# EAGLE design Burn_bootloader_V1.2 (EAGLE 6.4)
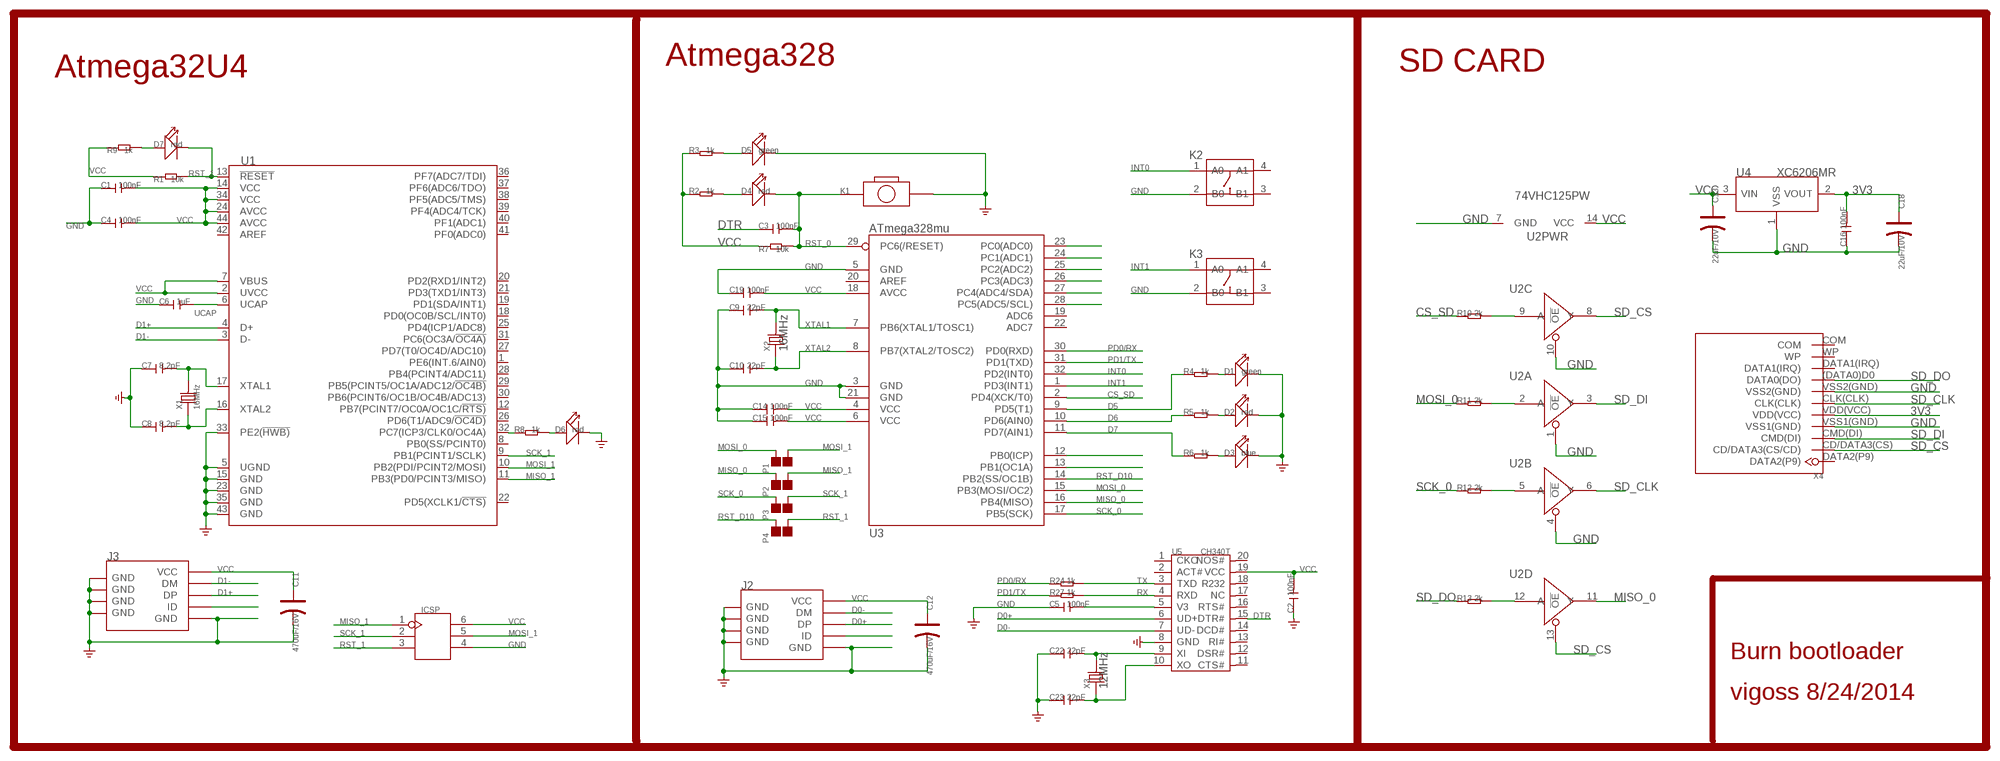
[diagram p0: schematic, sheet 1]

## Parts
C1  100nF  C-0603  [C0603]
C2  100nF  C-0603  [C0603]
C3  100nF  C-0603  [C0603]
C4  100nF  C-0603  [C0603]
C5  100nF  C-0603  [C0603]
C6  1uF  C-0603  [C0603]
C7  8.2pF  C-0603  [C0603]
C8  8.2pF  C-0603  [C0603]
C9  22pF  C-0603  [C0603]
C10  22pF  C-0603  [C0603]
C11  470uF/16V  CAP-AVX-C  [AVX-C]
C12  470uF/16V  CAP-AVX-C  [AVX-C]
C13  22uF/10V  CAP-AVX-A  [AVX-A]
C14  100nF  C-0603  [C0603]
C15  100nF  C-0603  [C0603]
C16  100nF  C-0805  [C0805]
C18  22uF/10V  CAP-AVX-A  [AVX-A]
C19  100nF  C-0603  [C0603]
C22  22pF  C-0603  [C0603]
C23  22pF  C-0603  [C0603]
D1  green  LED-6MM  [LED-2P-2.54-6MM]
D2  red  LED-6MM  [LED-2P-2.54-6MM]
D3  blue  LED-6MM  [LED-2P-2.54-6MM]
D4  red  LED'0603'  [LED-0603]
D5  green  LED'0603'  [LED-0603]
D6  red  LED'0603'  [LED-0603]
D7  red  LED'0603'  [LED-0603]
ICSP  HEADER-2X3P-2.54  [2X3P-2.54]
J2  USB-MINIUSB-5P-STRONG  [MINI-SMD-5P]
J3  USB-MINIUSB-5P-STRONG  [MINI-SMD-5P]
K1  BUTTON-2P'TS-1101F'  [2P-3.4X6.0X3.55H-90D]
K2  BUTTON-4P-6.2X6.2  [4P-6.2X6.2]
K3  BUTTON-4P-6.2X6.2  [4P-6.2X6.2]
P1  PAD-JUMPER-2P  [2P-SMD-1.78X1.27]
P2  PAD-JUMPER-2P  [2P-SMD-1.78X1.27]
P3  PAD-JUMPER-2P  [2P-SMD-1.78X1.27]
P4  PAD-JUMPER-2P  [2P-SMD-1.78X1.27]
R1  10k  R-0603  [R0603]
R2  1k  R-0603  [R0603]
R3  1k  R-0603  [R0603]
R4  1k  R-0603  [R0603]
R5  1k  R-0603  [R0603]
R6  1k  R-0603  [R0603]
R7  10k  R-0603  [R0603]
R8  1k  R-0603  [R0603]
R9  1k  R-0603  [R0603]
R10  2k  R-0603  [R0603]
R11  2k  R-0603  [R0603]
R12  2k  R-0603  [R0603]
R13  2k  R-0603  [R0603]
R24  1k  R-0603  [R0603]
R27  1k  R-0603  [R0603]
U1  MCU-ATMEGA32U4  [TEST-VQFN-44]
U2  74VHC125PW  [TSSOP14]
U3  ATmega328mu  ATMEGA8/168/328  [TQFP32]
U4  XC6206MR  [SOT23]
U5  CH340T  [SSOP20]
X1  16MHz  CRYSTAL'5032'  [2P-SMD-5X3.2]
X2  16MHz  CRYSTAL'5032'  [2P-SMD-5X3.2]
X3  12MHz  CRYSTAL'5032'  [2P-SMD-5X3.2]
X4  SDCARDEXTDEVICE  [SDCARDEXTPACKAGE]

## Nets
3V3: C16.2 C18.+ U4.2(VOUT) X4.VDD(VCC)
CS_SD: R10.1 U3.2(PD4(XCK/T0))
D0+: J2.3(DP) U5.6(UD+)
D0-: J2.2(DM) U5.7(UD-)
D1+: J3.3(DP) U1.4(D+)
D1-: J3.2(DM) U1.3(D-)
D5: R4.1 U3.9(PD5(T1))
D6: R5.1 U3.10(PD6(AIN0))
D7: R6.1 U3.11(PD7(AIN1))
DTR: C3.1 U5.15(DTR#)
GND [none1]: C1.1 C2.1 C4.1 C5.1 C6.1 C7.1 C8.1 C9.1 C10.1 C11.- C12.- C13.- C14.1 C15.1 C16.1 C18.- C19.1 C22.1 C23.1 D1.- D2.- D3.- D5.- D6.- ICSP.4 J2.5(GND) J2.GND@1(GND) J2.GND@2(GND) J2.GND@3(GND) J2.GND@4(GND) J3.5(GND) J3.GND@1(GND) J3.GND@2(GND) J3.GND@3(GND) J3.GND@4(GND) K1.P$2 K2.2(B0) K3.2(B0) U1.5(UGND) U1.15(GND) U1.23(GND) U1.33(PE2(!HWB)) U1.35(GND) U1.43(GND) U2.1(A:!OE) U2.4(B:!OE) U2.7(PWR:GND) U2.10(C:!OE) U3.3(GND) U3.5(GND) U3.21(GND) U4.1(VSS) U5.8(GND) X4.VSS1(GND) X4.VSS2(GND)
INT0: K2.1(A0) U3.32(PD2(INT0))
INT1: K3.1(A0) U3.1(PD3(INT1))
MISO_0: P2.2 U2.11(D:Y) U3.16(PB4(MISO))
MISO_1: ICSP.1 P2.1 U1.11(PB3(PD0/PCINT3/MISO))
MOSI_0: P1.2 R11.1 U3.15(PB3(MOSI/OC2))
MOSI_1: ICSP.5 P1.1 U1.10(PB2(PDI/PCINT2/MOSI))
N$1: J2.4(ID)
N$2: J3.4(ID)
N$3: D1.+ R4.2
N$4: D2.+ R5.2
N$5: D4.+ R2.2
N$6: D5.+ R3.2
N$7: D3.+ R6.2
N$8: R8.1 U1.32(PC7(ICP3/CLK0/OC4A))
N$9: D6.+ R8.2
N$10: D7.+ R9.2
N$11: C7.2 U1.17(XTAL1) X1.2
N$12: C8.2 U1.16(XTAL2) X1.1
N$13: R13.2 U2.12(D:A)
N$14: R12.2 U2.5(B:A)
N$15: R11.2 U2.2(A:A)
N$16: R10.2 U2.9(C:A)
N$17: U3.23(PC0(ADC0))
N$18: U3.24(PC1(ADC1))
N$19: U3.25(PC2(ADC2))
N$20: U3.26(PC3(ADC3))
N$21: U3.27(PC4(ADC4/SDA))
N$22: U3.28(PC5(ADC5/SCL))
N$23: U3.12(PB0(ICP))
N$24: U3.13(PB1(OC1A))
N$39: C22.2 U5.9(XI) X3.2
N$40: C23.2 U5.10(XO) X3.1
PD0/RX: R24.1 U3.30(PD0(RXD))
PD1/TX: R27.1 U3.31(PD1(TXD))
RST_0: C3.2 D4.- K1.P$1 R7.2 U3.29(PC6(/RESET))
RST_1: D7.- ICSP.3 P4.1 R1.2 U1.13(!RESET)
RST_D10: P4.2 U3.14(PB2(SS/OC1B))
RX: R27.2 U5.4(RXD)
SCK_0: P3.2 R12.1 U3.17(PB5(SCK))
SCK_1: ICSP.2 P3.1 U1.9(PB1(PCINT1/SCLK))
SD_CLK: U2.6(B:Y) X4.CLK(CLK)
SD_CS: U2.8(C:Y) U2.13(D:!OE) X4.CD/DATA3(CS)(CD/DATA3(CS/CD))
SD_DI: U2.3(A:Y) X4.CMD(DI)
SD_DO: R13.1 X4.(DATA0)D0(DATA0(DO))
TX: R24.2 U5.3(TXD)
UCAP: C6.2 U1.6(UCAP)
V3: C5.2 U5.5(V3)
VCC: C1.2 C2.2 C4.2 C11.+ C12.+ C13.+ C14.2 C15.2 C19.2 ICSP.6 J2.1(VCC) J3.1(VCC) R1.1 R2.1 R3.1 R7.1 R9.1 U1.2(UVCC) U1.7(VBUS) U1.14(VCC) U1.24(AVCC) U1.34(VCC) U1.44(AVCC) U2.14(PWR:VCC) U3.4(VCC) U3.6(VCC) U3.18(AVCC) U4.3(VIN) U5.19(VCC)
XTAL1: C9.2 U3.7(PB6(XTAL1/TOSC1)) X2.2
XTAL2: C10.2 U3.8(PB7(XTAL2/TOSC2)) X2.1
Unconnected: K2.3(B1) K2.4(A1) K3.3(B1) K3.4(A1) U1.1(PE6(INT.6/AIN0)) U1.8(PB0(SS/PCINT0)) U1.12(PB7(PCINT7/OC0A/OC1C/!RTS)) U1.18(PD0(OC0B/SCL/INT0)) U1.19(PD1(SDA/INT1)) U1.20(PD2(RXD1/INT2)) U1.21(PD3(TXD1/INT3)) U1.22(PD5(XCLK1/!CTS)) U1.25(PD4(ICP1/ADC8)) U1.26(PD6(T1/ADC9/!OC4D)) U1.27(PD7(T0/OC4D/ADC10)) U1.28(PB4(PCINT4/ADC11)) U1.29(PB5(PCINT5/OC1A/ADC12/!OC4B)) U1.30(PB6(PCINT6/OC1B/OC4B/ADC13)) U1.31(PC6(OC3A/!OC4A)) U1.36(PF7(ADC7/TDI)) U1.37(PF6(ADC6/TDO)) U1.38(PF5(ADC5/TMS)) U1.39(PF4(ADC4/TCK)) U1.40(PF1(ADC1)) U1.41(PF0(ADC0)) U1.42(AREF) U3.19(ADC6) U3.20(AREF) U3.22(ADC7) U5.1(CKO) U5.2(ACT#) U5.11(CTS#) U5.12(DSR#) U5.13(RI#) U5.14(DCD#) U5.16(RTS#) U5.17(NC) U5.18(R232) U5.20(NOS#) X4.COM X4.DATA1(IRQ) X4.DATA2(P9) X4.WP

## Notes on the sheet
- Atmega328 | SD CARD
- Atmega32U4
- Burn bootloader
- vigoss 8/24/2014

## Library data of the parts
C1-C10 C14-C16 C19 C22 C23 = Discrete:C*: Ceramic Capacitors
C11-C13 C18 = Discrete:CAP*: Electrolytic Capacitors,Tantalum Capacitors and Super Capacitors
D1-D7 = Discrete:LED*
ICSP = Connector :HEADER-2X3P
J2 J3 = Connector :USB-MINIUSB-5P
K1 = Discrete:BUTTON-2P
K2 K3 = Discrete:BUTTON-4P
P1-P4 = Discrete:PAD-JUMPER-2P; PARTNO: DNP
R1-R13 R24 R27 = Discrete:R*
U1 = goodman:MCU-ATMEGA32U4
U2 = IC:74V*125: Quad Buffer/Line Driver;3-state
U3 = IC:ATMEGA8/168/328: MICROCONTROLLER
U4 = IC:XC6206: LOW ESR Cap.Compatible Positive Voltage Regulators
U5 = template:CH340T
X1-X3 = Discrete:CRYSTAL*: CRYSTAL
X4 = SD card breakout:SDCARDEXTDEVICE

## Net classes
0 default: clearance 0.152 mm
3 none3: width 0.203 mm, drill 0.305 mm, clearance 0.203 mm

## Board
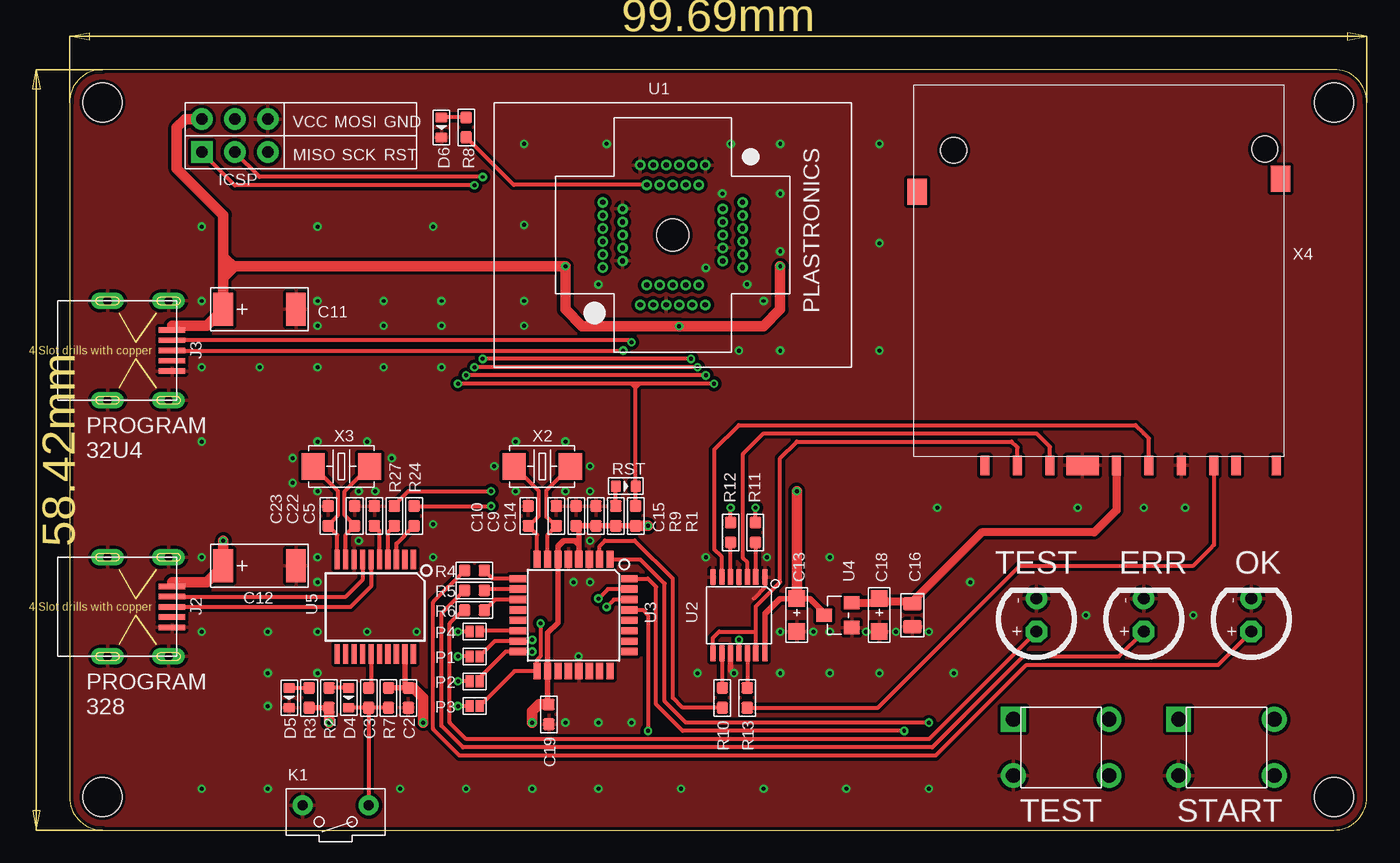
[diagram p1: board, top side]
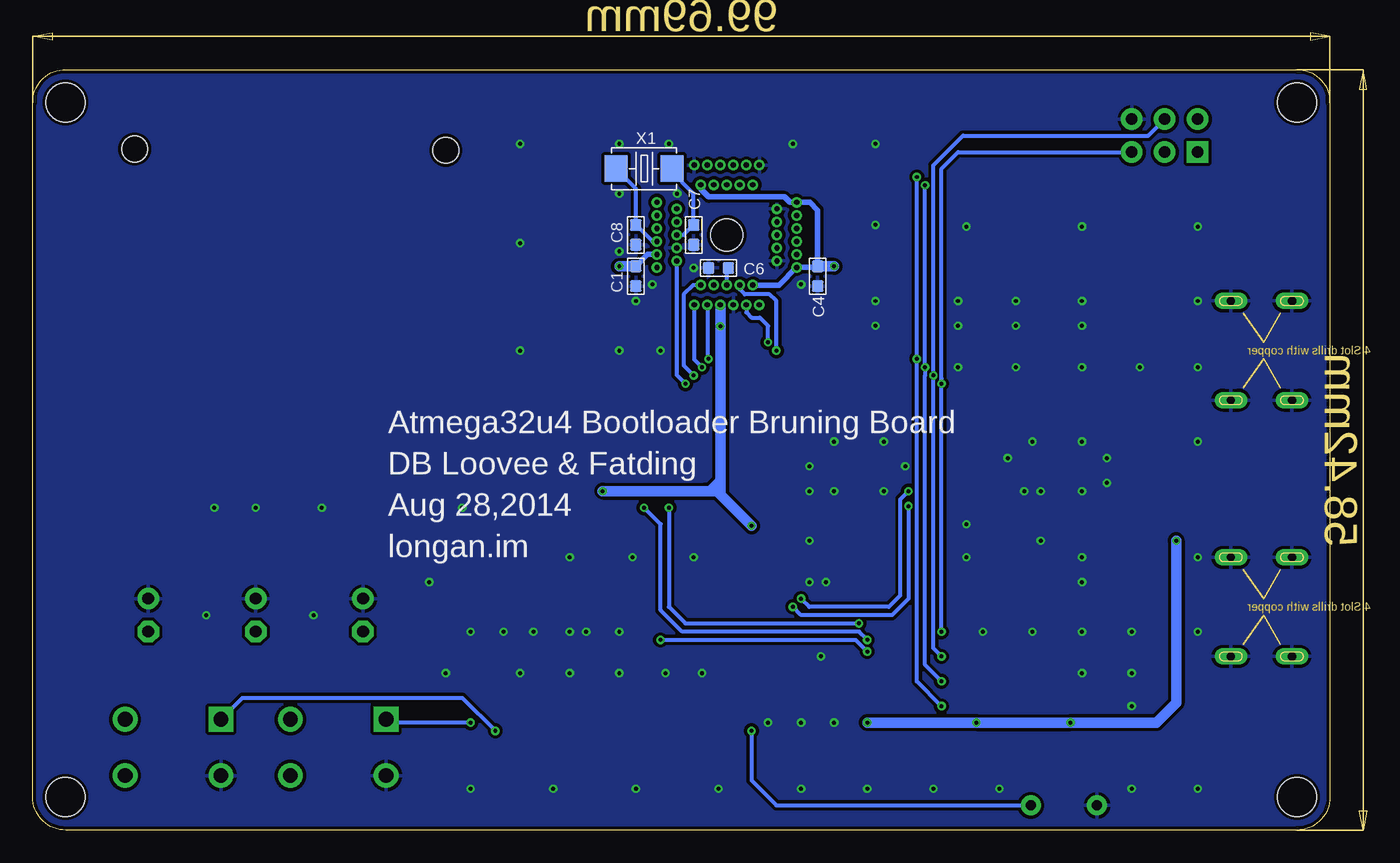
[diagram p2: board, bottom side, seen from below]

Size 99.69 x 58.42 mm. Coordinates in mm from the lower left corner, seen from the top.
Outline: 97.16,58.42 2.54,58.42 arc90 0,55.88 0,2.54 arc90 2.54,0 97.16,0 arc90 99.69,2.54 99.69,55.88 arc90 97.16,58.42
Copper layers (1*16): Top 0.035mm / dielectric 1.5mm / Bottom 0.035mm
Design rules "SeeedStudio_2layer_DRU_no_angle_20140221 *": minimum track width 6mil, minimum drill 12mil, track to track 6mil, track to pad 6mil, pad to pad 6mil, via to via 6mil, smd to smd 0mil, copper to edge 10mil, drill to drill 10mil, minimum pad ring 5mil, minimum via ring 6mil, stop-mask expansion 2mil, vias tented up to drill 100mil, thermal gap 10mil
Holes 3 mm at 2.54,55.88 2.54,2.54 97.16,2.54 97.16,55.88

### Footprints (pad centres in the part's own frame; a part is rotated, then mirrored left to right if it is on the bottom)
C0603 = smd 0.889 x 0.889: 1 -0.762,0; 2 0.762,0
AVX-C = smd 1.524 x 2.54: + -2.794,0; - 2.794,0
AVX-A = smd 1.27 x 1.27: + -1.27,0; - 1.27,0
C0805 = smd 1.016 x 1.397: 1 -0.889,0; 2 0.889,0
LED-2P-2.54-6MM = drill 0.889 pad 1.651 octagon: + -1.27,0 | drill 0.889 pad 1.651: - 1.27,0
LED-0603 = smd 0.762 x 0.889: + -0.762,0; - 0.762,0
2X3P-2.54 = drill 0.889 pad 1.651 square: 1 -1.27,2.54 | drill 0.889 pad 1.651: 2 -1.27,0; 3 -1.27,-2.54; 4 1.27,-2.54; 5 1.27,0; 6 1.27,2.54
MINI-SMD-5P = smd 2.032 x 0.406: 1 0.381,-1.575; 2 0.381,-0.787; 3 0.381,0; 4 0.381,0.787; 5 0.381,1.575 | drill 0.635 pad 1.27 long: GND@1 0.635,3.81; GND@2 5.334,3.81; GND@3 5.334,-3.81; GND@4 0.635,-3.81
2P-3.4X6.0X3.55H-90D = drill 0.762 pad 1.524: P$1 0,2.54; P$2 0,-2.54
4P-6.2X6.2 = drill 1.143 pad 1.905 square: 1 -3.683,2.159 | drill 1.143 pad 1.905: 2 -3.683,-2.159; 3 3.683,-2.159; 4 3.683,2.159
2P-SMD-1.78X1.27 = smd 0.889 x 0.61: 1 0,0.381; 2 0,-0.381
R0603 = smd 0.889 x 0.889: 1 -0.762,0; 2 0.762,0
TEST-VQFN-44 = drill 0.4 pad 0.8: 1 -2.5,-5.37; 2 -2,-3.85; 3 -1.5,-5.37; 4 -1,-3.85; 5 -0.5,-5.37; 6 0,-3.85; 7 0.5,-5.37; 8 1,-3.85; 9 1.5,-5.37; 10 2,-3.85; 11 2.5,-5.37; 12 5.37,-2.5; 13 3.85,-2; 14 5.37,-1.5; 15 3.85,-1; 16 5.37,-0.5; 17 3.85,0; 18 5.37,0.5; 19 3.85,1; 20 5.37,1.5; 21 3.85,2; 22 5.37,2.5; 23 2.5,5.37; 24 2,3.85; 25 1.5,5.37; 26 1,3.85; 27 0.5,5.37; 28 0,3.85; 29 -0.5,5.37; 30 -1,3.85; 31 -1.5,5.37; 32 -2,3.85; 33 -2.5,5.37; 34 -5.37,2.5; 35 -3.85,2; 36 -5.37,1.5; 37 -3.85,1; 38 -5.37,0.5; 39 -3.85,0; 40 -5.37,-0.5; 41 -3.85,-1; 42 -5.37,-1.5; 43 -3.85,-2; 44 -5.37,-2.5 | hole 2.5: 0,0
TSSOP14 = smd 0.4 x 1.2: 1 -2,-2.925; 2 -1.3,-2.925; 3 -0.65,-2.925; 4 0,-2.925; 5 0.65,-2.925; 6 1.3,-2.925; 7 2,-2.925; 8 2,2.925; 9 1.3,2.925; 10 0.65,2.925; 11 0,2.925; 12 -0.65,2.925; 13 -1.3,2.925; 14 -2,2.925
TQFP32 = smd 1.27 x 0.559: 1 -4.293,2.8; 2 -4.293,2; 3 -4.293,1.2; 4 -4.293,0.4; 5 -4.293,-0.4; 6 -4.293,-1.2; 7 -4.293,-2; 8 -4.293,-2.8; 17 4.293,-2.8; 18 4.293,-2; 19 4.293,-1.2; 20 4.293,-0.4; 21 4.293,0.4; 22 4.293,1.2; 23 4.293,2; 24 4.293,2.8 | smd 0.559 x 1.27: 9 -2.8,-4.293; 10 -2,-4.293; 11 -1.2,-4.293; 12 -0.4,-4.293; 13 0.4,-4.293; 14 1.2,-4.293; 15 2,-4.293; 16 2.8,-4.293; 25 2.8,4.293; 26 2,4.293; 27 1.2,4.293; 28 0.4,4.293; 29 -0.4,4.293; 30 -1.2,4.293; 31 -2,4.293; 32 -2.8,4.293
SOT23 = smd 1.016 x 1.2: 1 -0.95,-1.06; 2 0.95,-1.06; 3 0,1.06
SSOP20 = smd 0.4 x 1.5: 1 -2.925,-3.625; 2 -2.275,-3.625; 3 -1.625,-3.625; 4 -0.975,-3.625; 5 -0.325,-3.625; 6 0.325,-3.625; 7 0.975,-3.625; 8 1.625,-3.625; 9 2.275,-3.625; 10 2.925,-3.625; 11 2.925,3.625; 12 2.275,3.625; 13 1.625,3.625; 14 0.975,3.625; 15 0.325,3.625; 16 -0.325,3.625; 17 -0.975,3.625; 18 -1.625,3.625; 19 -2.275,3.625; 20 -2.925,3.625
2P-SMD-5X3.2 = smd 1.778 x 2.032: 1 -2.159,0; 2 2.159,0
SDCARDEXTPACKAGE = smd 1.5 x 0.7: (DATA0)D0 -15.8,-9.2; CD/DATA3(CS) -15.8,5.9; CLK(CLK) -15.8,-4.2; CMD(DI) -15.8,3.4; DATA1(IRQ) -15.8,-10.9; DATA2(P9) -15.8,8.4; VDD(VCC) -15.8,-1.7; VSS2(GND) -15.8,-6.7; WP -15.8,-14 | smd 2 x 1.5: COM 6.2,-14.3; P$2 5.2,13.6 | smd 1.5 x 2.5: VSS1(GND) -15.8,0.9 | hole 2: 8.4,10.8; 8.5,-13.1

### Placement (x,y rotation side)
C1  53.34,42.55 90 bottom
C2  26.04,10.16 90 top
C3  22.99,10.16 270 top
C4  39.37,42.55 90 bottom
C5  23.43,24.13 270 top
C6  46.99,43.18 0 bottom
C7  48.9,45.72 90 bottom
C8  53.34,45.72 90 bottom
C9  37.4,24.13 270 top
C10  35.24,24.13 270 top
C11  14.61,40.01 0 top
C12  14.61,20.32 0 top
C13  55.88,16.51 270 top
C14  38.93,24.13 270 top
C15  40.45,24.13 270 top
C16  64.77,16.51 90 top
C18  62.23,16.51 270 top
C19  36.83,8.89 90 top
C22  21.91,24.13 270 top
C23  19.88,24.13 270 top
D1  90.81,16.51 90 top
D2  82.55,16.51 90 top
D3  74.3,16.51 90 top
D4  21.46,10.16 270 top
D5  16.89,10.16 270 top
D6  28.57,53.98 270 top
D7  42.74,26.42 0 top
ICSP  12.7,53.34 90 top
J2  8.26,17.14 180 top
J3  8.26,36.83 180 top
K1  20.45,1.91 270 top
K2  88.9,6.35 0 top
K3  76.2,6.35 0 top
P1  31.11,13.34 90 top
P2  31.11,11.43 90 top
P3  31.11,9.53 90 top
P4  31.11,15.24 90 top
R1  43.5,24.13 90 top
R2  19.94,10.16 90 top
R3  18.41,10.16 90 top
R4  31.11,19.94 180 top
R5  31.11,18.41 180 top
R6  31.11,16.89 180 top
R7  24.51,10.16 270 top
R8  30.48,53.98 90 top
R9  41.97,24.13 90 top
R10  50.16,10.16 90 top
R11  52.7,22.86 270 top
R12  50.8,22.86 270 top
R13  52.07,10.16 90 top
R24  26.48,24.13 270 top
R27  24.96,24.13 270 top
U1  46.35,45.72 0 top
U2  51.44,16.51 180 top
U3  38.73,16.51 270 top
U4  59.05,16.51 90 top
U5  23.5,17.14 180 top
X1  52.7,50.8 0 bottom
X2  36.32,27.94 0 top
X3  20.89,27.94 0 top
X4  78.74,43.81 90 top

### Tracks (layer width: path | path; a pad name or v marks a point on that pad's centre or on a via)
3V3
  Top 0.61: C16.2 64.77,17.53 | 64.77,17.53 62.48,17.53 C18.+ 61.91,17.46 U4.2 | X4.VDD(VCC) 80.44,24.56 78.74,22.86 70.1,22.86 64.77,17.53
CS_SD
  Top 0.305: U3.2 40.73,21.81 41.15,22.23 43.43,22.23 46.35,19.3 46.35,10.16 47.12,9.4 R10.1
D0+
  Top 0.305: J2.3 21.59,17.14 23.17,18.73 U5.6
D0-
  Top 0.305: J2.2 21.23,17.93 22.52,19.22 U5.7
D1+  (via drill 0.3 pad 0.64)
  Top 0.305: J3.3 v42.55,36.83
  Bottom 0.305: v42.55,36.83 42.55,40.64 43.05,41.15 44.96,41.15 45.34,41.53 45.34,41.85 U1.4
D1-  (via drill 0.3 pad 0.64)
  Top 0.305: J3.2 43.03,37.62 v43.18,37.47
  Bottom 0.305: v43.18,37.47 43.18,38.73 43.81,39.37 44.45,39.37 44.85,39.77 U1.3
D5
  Top 0.305: U3.9 32.51,19.31 R4.1
D6
  Top 0.305: U3.10 31.97,18.51 R5.1
D7
  Top 0.305: U3.11 32.7,17.71 R6.1
DTR
  Top 0.305: U5.15 23.17,11.11 C3.1
GND  (via drill 0.3 pad 0.64)
  Top 0.305: U2.1 53.44,18.64 52.58,17.78
  Top 0.406: U2.10 50.78,12.33 v51.05,12.06
  other vias: 19.05,40.64 19.05,38.73 57.15,15.24 58.42,15.24 54.61,15.24 61.21,15.24 63.5,15.24 66.04,15.24 53.59,20.95 48.9,20.95 40.01,22.23 40.01,19.05 39.12,13.34 38.73,19.05 38.1,8.26 40.64,8.26 43.18,8.26 19.05,20.95 19.05,19.05 22.23,22.23 19.05,29.84 22.86,29.84 23.5,26.04 22.23,26.04 24.77,28.57 17.14,28.57 19.05,26.04 17.14,26.67 32.64,27.94 34.29,29.84 38.1,29.84 40.01,27.94 40.01,26.04 38.1,26.04 34.29,26.04 40.64,41.91 48.9,43.18 52.07,41.91 53.34,40.64 54.61,44.45 50.16,48.9 54.61,48.9 54.61,52.7 50.8,52.7 10.16,15.24 10.16,20.95 10.16,35.56 10.16,40.64 28.57,40.64 28.57,38.73 34.92,40.64 34.92,38.73 27.94,23.5 27.94,20.95 15.24,9.53 15.24,15.24 19.05,15.24 19.05,12.06 15.24,12.06 25.4,3.17 30.48,3.17 35.56,3.17 40.64,3.17 10.16,3.17 15.24,3.17 22.86,15.24 26.67,15.24 54.61,12.06 58.42,12.06 62.23,12.06 67.94,12.06 78.11,16.51 86.36,16.51 82.55,24.77 85.72,24.77 77.47,24.77 69.22,19.05 19.05,46.35 27.94,46.35 34.92,46.48 34.92,52.7 41.27,52.7 54.61,36.83 51.44,36.83 46.99,3.17 53.34,3.17 59.69,3.17 66.04,3.17 62.23,52.7 62.23,36.83 62.23,45.09 10.16,29.84 14.61,35.56 19.05,35.56 28.57,35.56 24.13,40.64 24.13,38.73 24.13,35.56 48.26,12.06 66.67,24.77 58.42,20.95 10.16,46.35
  pour Bottom (isolate 0.254): 0,0 99.69,0 99.69,58.42 0,58.42
  pour Top (isolate 0.254): 0,0 99.69,0 99.69,58.42 0,58.42
INT0  (via drill 0.3 pad 0.64)
  Top 0.305: U3.32 44.44,19.31 45.02,18.73 45.09,18.67 45.09,9.65 47.12,7.62 v64.14,7.62
  Bottom 0.305: K2.1 83.57,10.16 66.67,10.16 v64.14,7.62
INT1  (via drill 0.3 pad 0.64)
  Top 0.305: U3.1 43.84,20.8 45.72,18.92 45.72,9.91 47.37,8.26 v66.04,8.26
  Bottom 0.305: v66.04,8.26 72.26,8.26 K3.1
MISO_0  (via drill 0.3 pad 0.64)
  Top 0.305: U2.11 v51.44,14.61 | v35.56,13.72 U3.16 33.52,13.71 31.5,11.68 P2.2
  Bottom 0.305: v51.44,14.61 36.45,14.61 v35.56,13.72
MISO_1  (via drill 0.3 pad 0.64)
  Top 0.305: P2.1 v29.84,11.43 | ICSP.1 12.7,49.53 v31.11,49.53 | v48.26,35.56 v31.11,35.56
  Bottom 0.305: v29.84,11.43 31.11,12.7 31.11,34.92 v31.11,35.56 v31.11,49.53 | U1.11 48.85,36.15 v48.26,35.56
MOSI_0  (via drill 0.3 pad 0.64)
  Top 0.305: P1.2 32.67,14.51 U3.15 35.47,14.51 v35.56,14.61 | R11.1 v52.7,24.77
  Bottom 0.305: v35.56,14.61 36.2,15.24 49.78,15.24 51.44,16.89 51.44,23.5 v52.7,24.77
MOSI_1  (via drill 0.3 pad 0.64)
  Top 0.305: P1.1 v29.84,13.34 | v48.9,34.92 v30.48,34.92
  Bottom 0.305: v29.84,13.34 30.48,13.97 30.48,34.67 v30.48,34.92 30.48,51.05 28.19,53.34 13.97,53.34 ICSP.5 | U1.10 48.94,41.87 49.66,41.15 49.66,35.69 v48.9,34.92
N$3
  Top 0.305: R4.2 27.94,17.53 27.94,7.75 29.97,5.71 66.55,5.71 73.53,12.7 88.27,12.7 D1.+
N$4
  Top 0.305: R5.2 28.57,16.64 28.57,8 30.23,6.35 66.29,6.35 73.28,13.34 80.64,13.34 D2.+
N$5
  Top 0.305: D4.+ R2.2
N$6
  Top 0.305: D5.+ R3.2
N$7
  Top 0.305: R6.2 30.23,16.89 29.21,15.88 29.21,8.26 30.48,6.99 66.04,6.99 D3.+
N$8
  Top 0.305: U1.32 34.13,49.56 R8.1
N$9
  Top 0.305: R8.2 D6.+
N$10
  Top 0.305: R9.2 D7.+
N$11
  Bottom 0.305: U1.17 49.66,45.72 C7.2 48.9,48.9 50.67,50.67 X1.2
N$12
  Bottom 0.305: U1.16 52.07,45.22 C8.2 53.34,49.28 X1.1
N$13
  Top 0.305: U2.12 52.09,10.94 R13.2
N$14
  Top 0.305: U2.5 50.78,22.08 R12.2
N$15
  Top 0.305: U2.2 52.73,22.07 R11.2
N$16
  Top 0.305: U2.9 50.13,10.95 R10.2
N$39
  Top 0.305: X3.2 21.14,26.04 21.14,24.19 21.91,23.43 C22.2 21.22,22.68 U5.9
N$40
  Top 0.305: X3.1 20.64,26.04 20.64,24.19 19.88,23.43 C23.2 20.57,22.67 U5.10
PD0/RX  (via drill 0.3 pad 0.64)
  Top 0.305: R24.1 v32.38,24.89 | v41.27,17.14 41.84,17.71 U3.30
  Bottom 0.305: v32.38,24.89 32.38,17.78 33.66,16.51 40.64,16.51 v41.27,17.14
PD1/TX  (via drill 0.3 pad 0.64)
  Top 0.305: R27.1 24.96,24.96 26.04,26.04 v32.38,26.04 | U3.31 41.37,18.51 v40.64,17.78
  Bottom 0.305: v40.64,17.78 40.01,17.14 33.91,17.14 33.02,18.03 33.02,25.4 v32.38,26.04
RST_0  (via drill 0.3 pad 0.64)
  Top 0.305: U3.29 44.05,16.91 44.45,16.51 v44.45,7.62 | R7.2 C3.2 | C3.2 D4.- | C3.2 K1.P$1
  Bottom 0.305: v44.45,7.62 44.45,3.81 42.55,1.91 K1.P$1
RST_1  (via drill 0.3 pad 0.64)
  Top 0.305: P4.1 v29.84,15.24 | R1.2 D7.- 43.5,34.23 43.56,34.29 | v49.53,34.29 43.81,34.29 | 43.81,34.29 43.56,34.29 | 43.56,34.29 43.18,34.29 | 43.18,34.29 v29.84,34.29 | 43.18,34.29 43.43,34.04 43.56,34.04 43.81,34.29
  Bottom 0.305: v29.84,15.24 v29.84,34.29 29.84,34.67 29.84,50.8 28.57,52.07 ICSP.3 | U1.13 50.2,34.96 v49.53,34.29
RST_D10
  Top 0.305: U3.14 31.57,15.31 P4.2
RX
  Top 0.305: U5.4 24.47,22.88 R27.2
SCK_0  (via drill 0.3 pad 0.64)
  Top 0.305: P3.2 34.19,12.22 U3.17 35.94,13.07 36.2,13.34 v36.2,15.88 | R12.1 v50.8,24.77
  Bottom 0.305: v50.8,24.77 50.8,17.14 49.53,15.88 v36.2,15.88
SCK_1  (via drill 0.3 pad 0.64)
  Top 0.305: P3.1 v29.84,9.53 | v31.75,50.16 14.61,50.16 ICSP.2 | v47.75,36.2 v31.75,36.2
  Bottom 0.305: v29.84,9.53 31.75,11.43 v31.75,36.2 v31.75,50.16 | U1.9 47.85,36.29 v47.75,36.2
SD_CLK
  Top 0.305: U2.6 50.13,20.98 49.53,21.59 49.53,29.21 51.44,31.11 81.92,31.11 82.55,30.48 82.61,30.42 82.94,30.09 X4.CLK(CLK)
SD_CS
  Top 0.305: U2.13 52.73,15.24 | 52.73,15.24 52.73,17.18 54.61,19.05 54.61,28.57 55.88,29.84 72.39,29.84 72.84,29.39 X4.CD/DATA3(CS) | U2.8 49.44,14.76 49.91,15.24 52.73,15.24
SD_DI
  Top 0.305: U2.3 52.09,20.56 51.75,20.89 51.75,28.89 53.34,30.48 74.3,30.48 75.34,29.43 X4.CMD(DI)
SD_DO
  Top 0.305: R13.1 62.1,9.4 73.03,20.32 86.36,20.32 87.38,21.34 87.63,21.59 87.94,21.9 X4.(DATA0)D0
TX
  Top 0.305: U5.3 25.12,22.01 R24.2
UCAP
  Bottom 0.305: U1.6 46.35,43.06 C6.2
V3
  Top 0.305: U5.5 23.82,22.98 C5.2
VCC  (via drill 0.3 pad 0.64)
  Top 0.406: J2.1 7.87,19.05 | J3.1 7.87,38.73 | U5.19 25.77,11.19 C2.2 R7.1 | R2.1 R3.1 | U3.4 39.13,22.23 | R1.1 R9.1 C15.2 C14.2 39.13,23.16 39.13,22.23 | 38.86,22.23 37.97,22.23 37.53,21.79 U3.6 37.53,15.95 36.73,15.14 U3.18 36.73,9.75 C19.2 | 38.86,22.23 39.13,22.23 | 38.86,22.23 39.12,21.97 | U2.14 53.44,16.61 54.61,17.78 C13.+ 56.9,17.78 57.78,16.89 57.78,16.72 U4.3
  Top 0.813: ICSP.6 8.89,54.61 8.26,53.98 8.26,50.8 11.81,47.24 11.81,43.31 | 7.87,19.05 10.54,19.05 C12.+ v11.81,22.23 | 7.87,38.73 10.54,38.73 C11.+ 11.81,43.31 | C13.+ v55.88,26.04 | v44.45,23.37 R1.1 | v54.61,43.31 54.61,40.01 53.31,38.7 v46.85,38.7 39.4,38.7 38.1,40.01 v38.1,43.31 12.7,43.31 | 12.57,43.31 11.81,43.31 | C2.2 26.42,10.92 27.18,10.16 v27.18,8.26 | v19.94,8.26 R2.1 | v35.56,8.26 35.56,9.14 36.07,9.65 C19.2 | 12.7,43.31 12.57,43.31 | 12.57,43.31 11.94,43.94 11.94,42.55 12.7,43.31
  Bottom 0.406: U1.14 52.43,44.22 C1.2 | U1.24 48.35,49.24 47.75,48.64 41.91,48.64 41.48,48.22 U1.34 39.96,48.22 39.37,47.62 C4.2 39.46,43.22 U1.44 42.33,41.87 U1.2
  Bottom 0.813: v55.88,26.04 48.01,26.04 47.62,26.04 | 47.62,26.04 47.12,26.04 46.86,25.78 | 46.86,25.78 46.85,25.77 | 46.85,25.77 v44.45,23.37 | 46.85,25.79 46.86,25.78 | U1.7 v46.85,38.7 46.85,25.77 | v54.61,43.31 C1.2 | v38.1,43.31 C4.2 | v35.56,8.26 v27.18,8.26 v19.94,8.26 13.34,8.26 11.81,9.78 v11.81,22.23 | 47.62,26.04 46.99,26.67
XTAL1
  Top 0.305: C9.2 37.21,23.37 | U3.7 36.73,22.7 C9.2 | C9.2 37.34,23.37 36.64,24.07 36.64,26.1 X2.2
XTAL2
  Top 0.305: U3.8 35.94,22.68 C10.2 35.31,23.37 36.07,24.13 36.07,26.04 X2.1

### Text on the board
tPlace: VCC | MOSI | GND | MISO | SCK | RST | PROGRAM | 32U4 | RST | TEST | ERR | OK | PROGRAM | 328 | TEST | START
bPlace: Atmega32u4 Bootloader Bruning Board | DB Loovee & Fatding | Aug 28,2014 | longan.im